# EAGLE design main-single-esp32 (EAGLE 9.6.2)
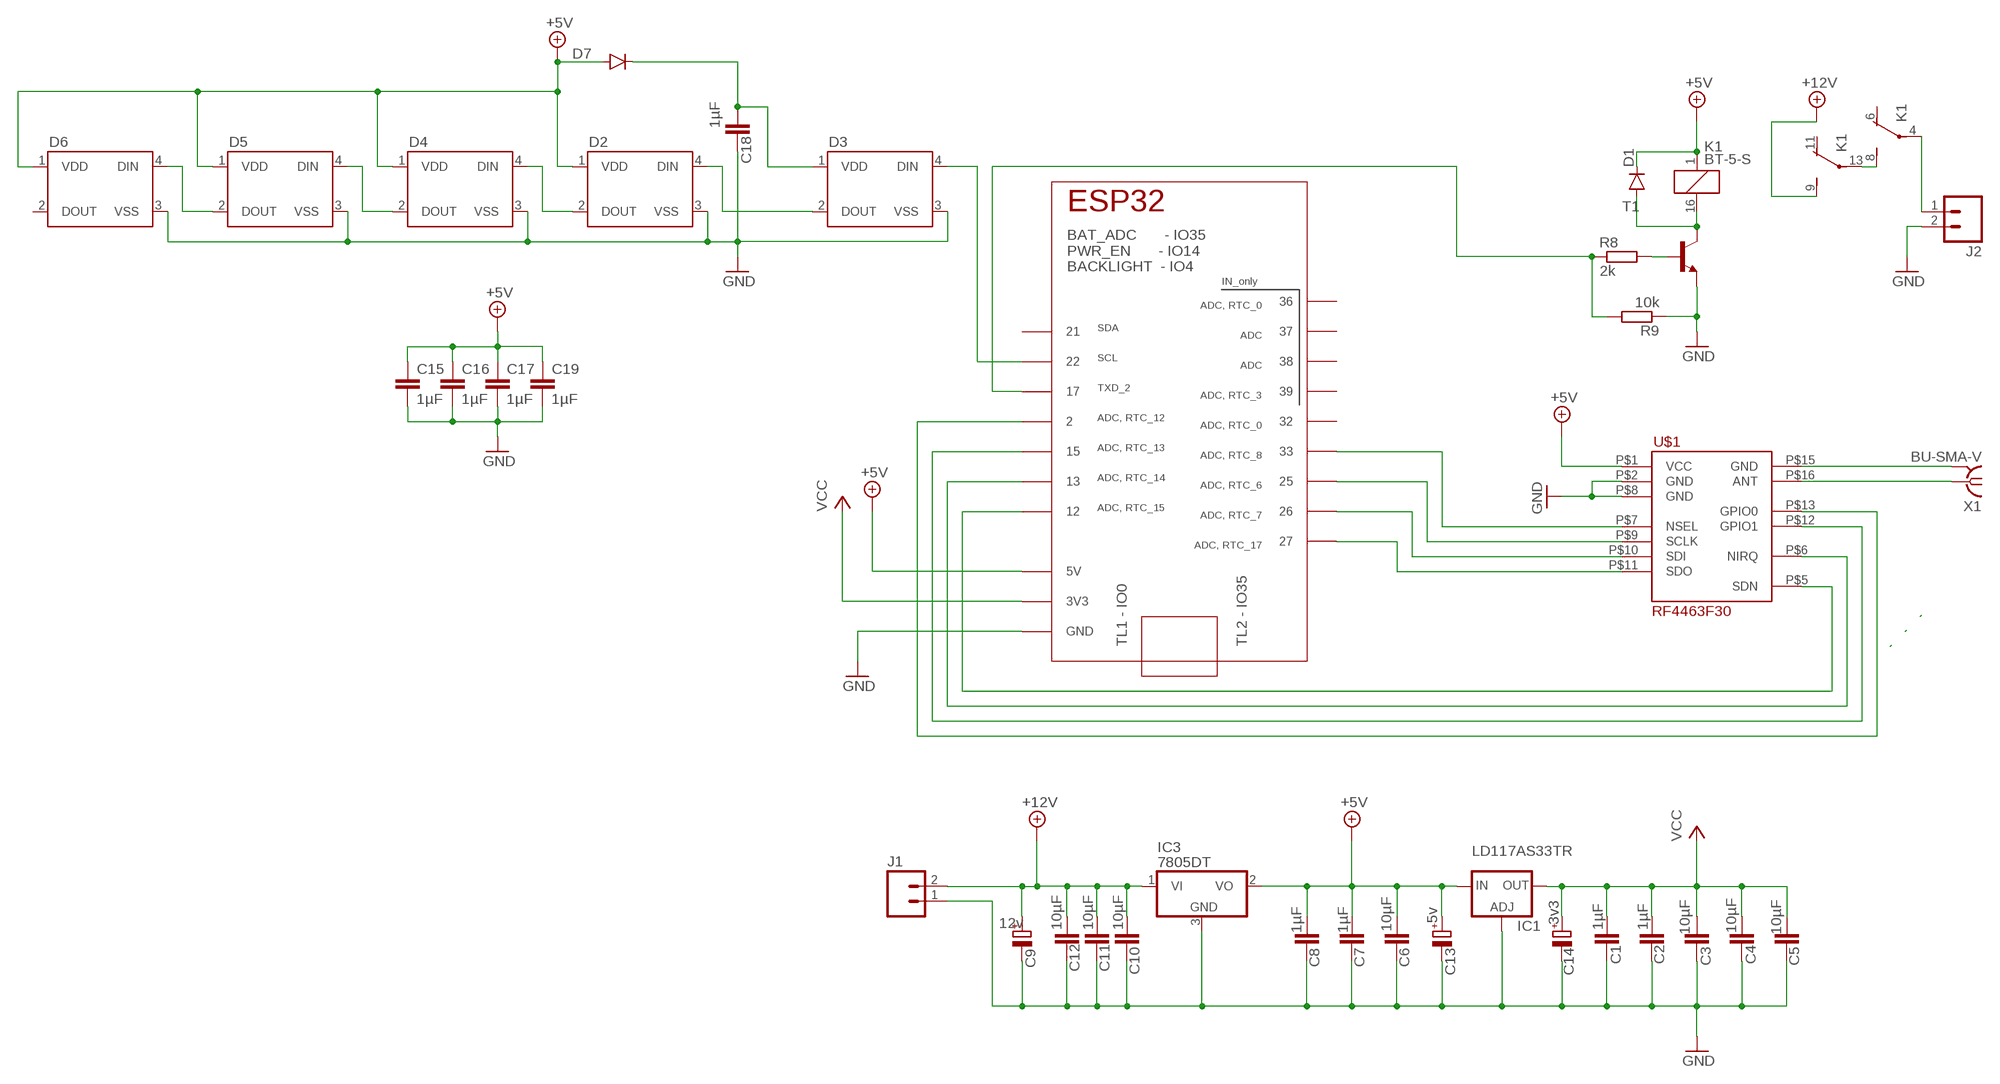
[diagram p0: schematic, sheet 1]

## Parts
C1  1µF  C-EUC1206K  [C1206K]
C2  1µF  C-EUC1206K  [C1206K]
C3  10µF  C-EUC1206K  [C1206K]
C4  10µF  C-EUC1206K  [C1206K]
C5  10µF  C-EUC1206K  [C1206K]
C6  10µF  C-EUC1206K  [C1206K]
C7  1µF  C-EUC1206K  [C1206K]
C8  1µF  C-EUC1206K  [C1206K]
C9  12v  CPOL-EUD/7343-31W  [D/7343-31W]
C10  10µF  C-EUC1206K  [C1206K]
C11  10µF  C-EUC1206K  [C1206K]
C12  10µF  C-EUC1206K  [C1206K]
C13  5v  CPOL-EUD/7343-31W  [D/7343-31W]
C14  3v3  CPOL-EUD/7343-31W  [D/7343-31W]
C15  1µF  C-EUC0805  [C0805]
C16  1µF  C-EUC0805  [C0805]
C17  1µF  C-EUC0805  [C0805]
C18  1µF  C-EUC0805  [C0805]
C19  1µF  C-EUC0805  [C0805]
D1  DIODESMA  [SMA-DIODE]
D2  WS2812B  [WS2812B]
D3  WS2812B  [WS2812B]
D4  WS2812B  [WS2812B]
D5  WS2812B  [WS2812B]
D6  WS2812B  [WS2812B]
D7  DIODESMA  [SMA-DIODE]
IC1  LD117AS33TR  [SOT223]
IC2  TTGO_DISP  [TTGO_DISP_DEFAULT]
IC3  7805DT  [TO252]
J1  M023.5MM-NO_SILK  [SCREWTERMINAL-3.5MM-2-NS]
J2  M023.5MM-NO_SILK  [SCREWTERMINAL-3.5MM-2-NS]
K1  BT-5-S  [BT-XX-S]
R8  2k  R-EU_R1206  [R1206]
R9  10k  R-EU_R1206  [R1206]
T1  MMBT2222ALT1-NPN-SOT23-BEC  [SOT23-BEC]
U$1  RF4463F30  [NICERF_16PIN_SPI_TRANSCEIVER]
X1  BU-SMA-V  [BU-SMA-V]

## Nets
+5V: C6.1 C7.1 C8.1 C13.+ C15.1 C16.1 C17.1 C19.1 D1.C D2.1(VDD) D4.1(VDD) D5.1(VDD) D6.1(VDD) D7.A IC1.3(IN) IC2.5V IC3.2(VO) K1.1 U$1.P$1(VCC)
+12V: C9.+ C10.1 C11.1 C12.1 IC3.1(VI) J1.2 K1.9(-2:S)
GND: C1.2 C2.2 C3.2 C4.2 C5.2 C6.2 C7.2 C8.2 C9.- C10.2 C11.2 C12.2 C13.- C14.- C15.2 C16.2 C17.2 C18.2 C19.2 D2.3(VSS) D3.3(VSS) D4.3(VSS) D5.3(VSS) D6.3(VSS) IC1.1(ADJ) IC2.GND_1(GND) IC2.GND_2(GND) IC2.GND_3(GND) IC2.GND_4(GND) IC2.GND_5(GND) IC3.3(GND) J1.1 J2.2 R9.1 T1.E U$1.P$2(GND) U$1.P$8(GND)
N$4: IC2.27 U$1.P$11(SDO)
N$6: IC2.26 U$1.P$10(SDI)
N$8: IC2.25 U$1.P$9(SCLK)
N$9: U$1.P$16(ANT) X1.1
N$10: U$1.P$15(GND) X1.2 X1.3 X1.4 X1.5
N$13: IC2.33 U$1.P$7(NSEL)
N$14: IC2.12 U$1.P$5(SDN)
N$15: R8.2 T1.B
N$16: D2.4(DIN) D3.2(DOUT)
N$17: D1.A K1.16 T1.C
N$18: IC2.13 U$1.P$6(NIRQ)
N$19: IC2.15 U$1.P$12(GPIO1)
N$20: IC2.2 U$1.P$13(GPIO0)
N$21: IC2.17 R8.1 R9.2
N$22: D2.2(DOUT) D4.4(DIN)
N$23: D4.2(DOUT) D5.4(DIN)
N$24: D5.2(DOUT) D6.4(DIN)
N$25: K1.8(-1:S) K1.13(-2:P)
N$26: J2.1 K1.4(-1:P)
N$27: D3.4(DIN) IC2.22
N$28: C18.1 D3.1(VDD) D7.C
VCC: C1.1 C2.1 C3.1 C4.1 C5.1 C14.+ IC1.4(OUT) IC2.3V3_1(3V3) IC2.3V3_2(3V3)
Unconnected: D6.2(DOUT) IC2.21 IC2.32 IC2.36 IC2.37 IC2.38 IC2.39 K1.6(-1:O) K1.11(-2:O)

## Library data of the parts
C1-C8 C10-C12 C15-C19 = rcl:C-EU: CAPACITOR, European symbol; SPICEPREFIX: C
C9 C13 C14 = rcl:CPOL-EU: POLARIZED CAPACITOR, European symbol; SPICEPREFIX: C
D1 D7 = SparkFun-DiscreteSemi:DIODE: Diode These are standard reverse protection diodes and small signal diodes. SMA package can handle up to about 1A. SOD-323 can handle about 200mA. What the SOD-323 package when ordering, there are some mfgs out there that are 5-pin packages.
D2-D6 = SparkFun-LED:WS2812B: WS2812B - Intelligent control LED integrated light source Technical Specifications: Power Supply Voltage (VDD): 3.5 to 5.3 V Input Voltage (VI): -0.5 to VDD+0.5 V Operating Junction Temperature (Topt): -25°C to +80°C Storage Temperature Range (Tstg): -55°C to +150°C; PROD_ID: DIO-12503
IC1 = v-reg:LD117A?*: Low drop fixed and adjustable positive voltage regulators 1 A Source: http://www.st.com/stonline/products/literature/ds/7194/ld1117axx.pdf
IC2 = TTGO_LCD_DISP:TTGO_DISP; HEIGHT: 11
IC3 = linear:78*: Positive VOLTAGE REGULATOR Source: http://cache.national.com/ds/LM/LM78L05.pdf http://www.fairchildsemi.com/ds/LM/LM7805.pdf
J1 J2 = SparkFun-Connectors:M02: Standard 2-pin 0.1" header. Use with - straight break away headers ( PRT-00116) - right angle break away headers (PRT-00553) - swiss pins (PRT-00743) - machine pins (PRT-00117) - female headers (PRT-00115) Molex polarized connector foot print use with: PRT-08233 with associated crimp pins and housings. 2.54_SCREWTERM for use with PRT-10571. 3.5mm Screw Terminal footprints for PRT-08084 5mm Screw Terminal footprints for use with PRT-08432; PROD_ID: CONN-08399
K1 = relay:BT-*-S: KLEIN RELAIS WASCHDICHT 2 Wechsler Distriibutor: Conrad Electronic, Bestell Nr.: 505226-13 - 24V 505226-13 - 5V 505170-13 - 12V 505170-13 - 48V Bestar Electric Ltd. Source: http://www2.produktinfo.conrad.com/datenblaetter/500000-524999/505226-da-01-en-Kleinrelais_waschdicht_24V.pdf; OC_FARNELL: unknown; OC_NEWARK: unknown
R8 R9 = resistor:R-EU_: RESISTOR, European symbol
T1 = transistor-neu-to92:*-NPN-: NPN Transistror
U$1 = Nomeo-Transceivers:RF4463F30
X1 = con-coax:BU-SMA-V: FEMALE SMA CONNECTOR Radiall distributor RS 112-3794; OC_FARNELL: unknown; OC_NEWARK: unknown

## Net classes
0 default: width 0.61 mm, drill 0.4 mm, clearance 0.254 mm

## Board
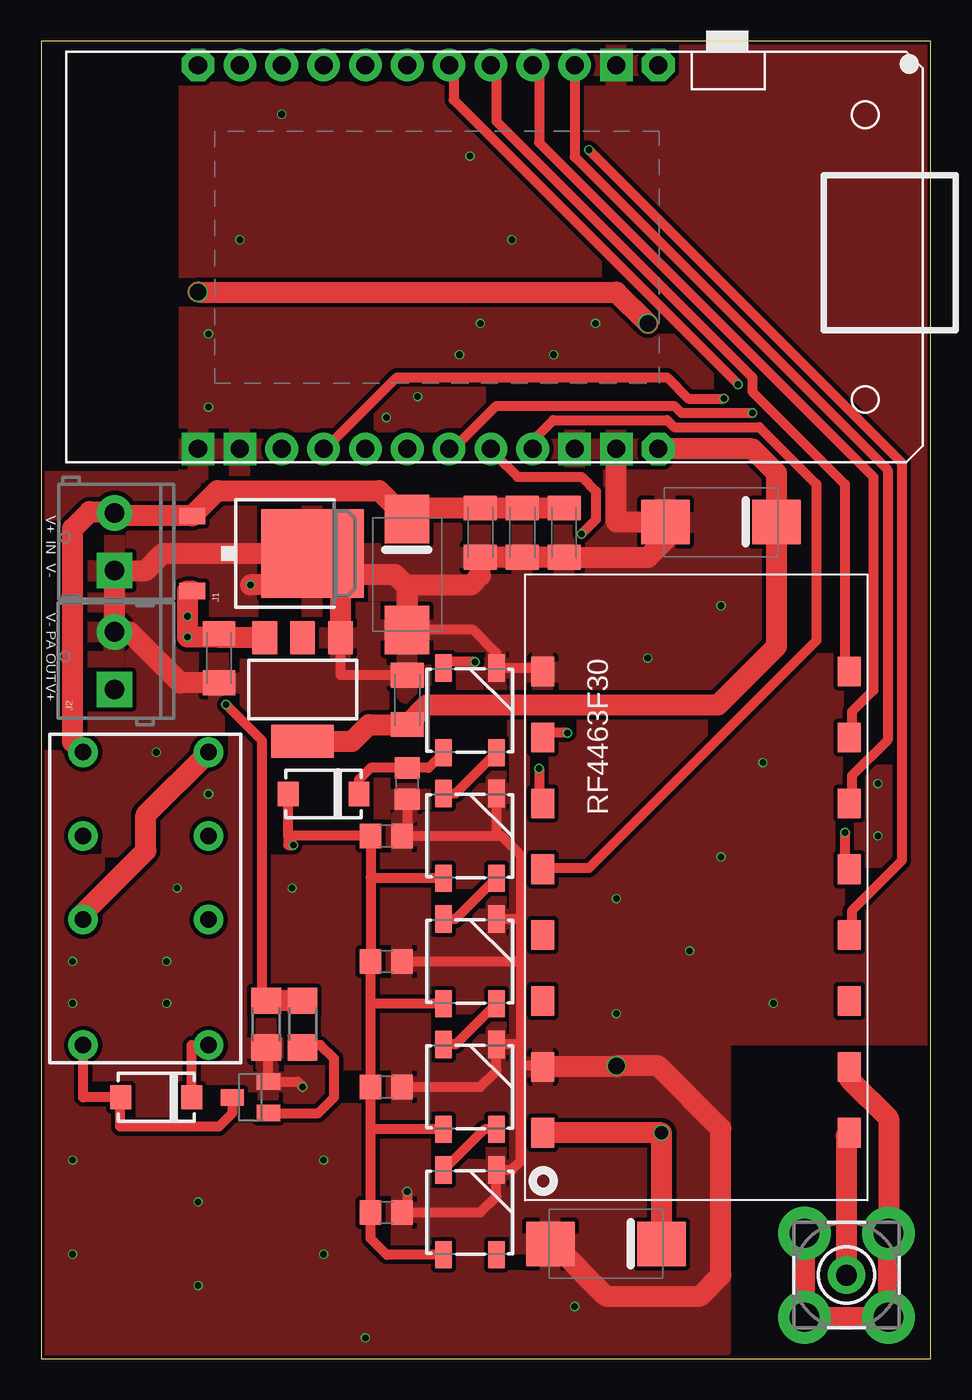
[diagram p1: board, top side]
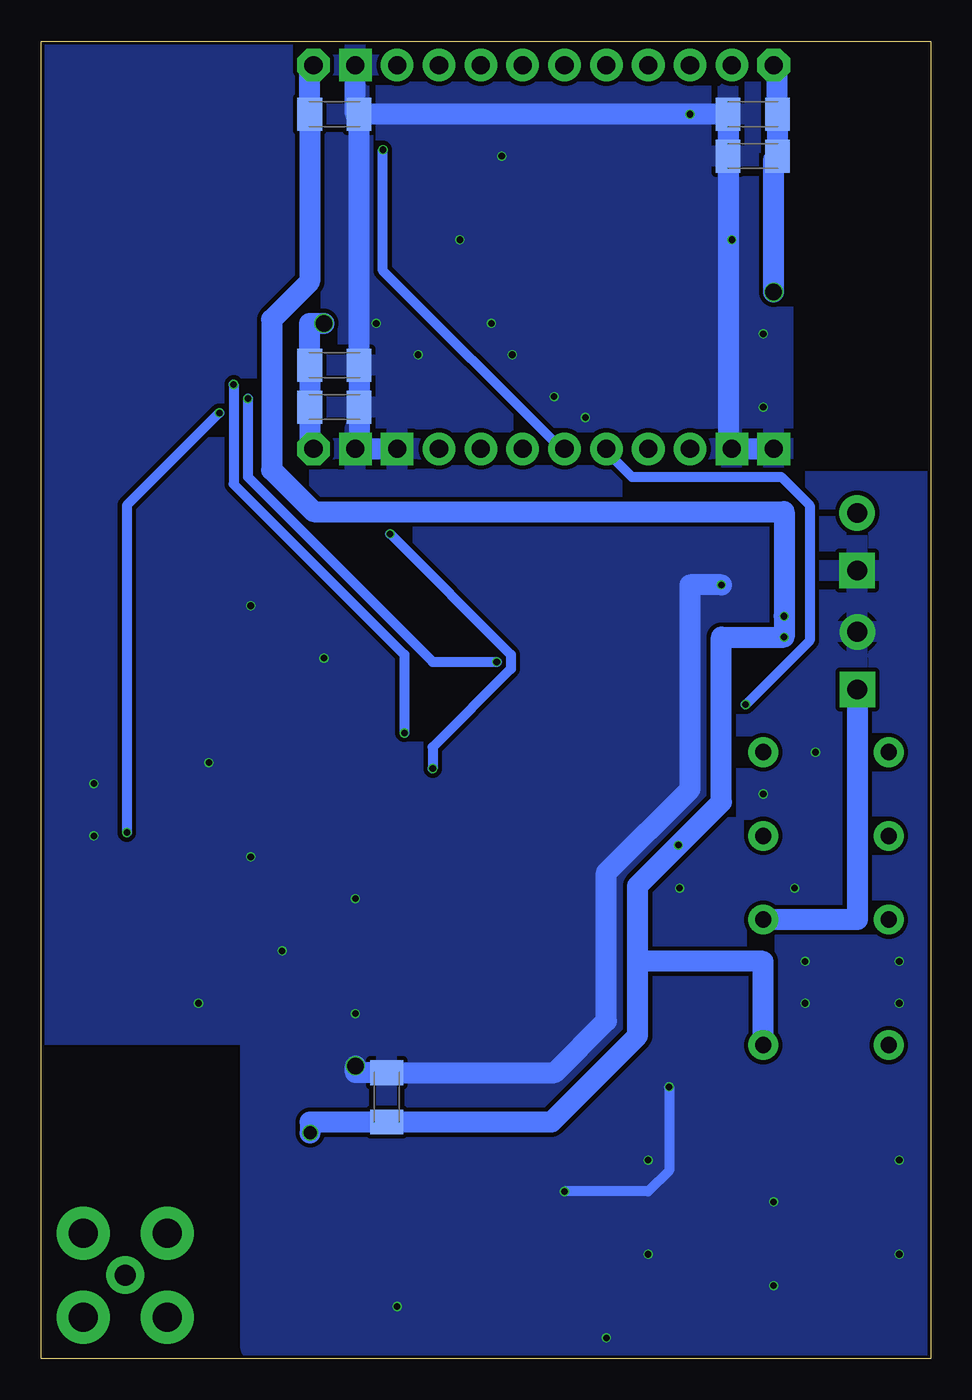
[diagram p2: board, bottom side, seen from below]

Size 54 x 80 mm. Coordinates in mm from the lower left corner, seen from the top.
Outline: 0,0 54,0 54,80 0,80 0,0
Copper layers (1*16): Top 0.035mm / dielectric 1.6mm / Bottom 0.035mm
Design rules "jlcpcb-2layers": minimum track width 5mil, minimum drill 0.3mm, track to track 5mil, track to pad 5mil, pad to pad 5mil, via to via 5mil, smd to smd 5mil, copper to edge 0.2mm, drill to drill 6mil, minimum pad ring 10mil, minimum via ring 3mil, stop-mask expansion 4mil, vias tented up to drill 0mil, thermal gap 10mil
tRestrict: area 0.6,54 to 8.3,79.4
bRestrict: area 0.6,54 to 8.3,79.4

### Footprints (pad centres in the part's own frame; a part is rotated, then mirrored left to right if it is on the bottom)
C1206K = smd 1.5 x 2: 1 -1.5,0; 2 1.5,0
D/7343-31W = smd 2.95 x 2.7: + 3.375,0; - -3.375,0
C0805 = smd 1.3 x 1.5: 1 -0.95,0; 2 0.95,0
SMA-DIODE = smd 1.27 x 1.47: A -2.15,0; C 2.15,0
WS2812B = smd 1.651 x 1: 1 -2.577,1.6; 2 -2.577,-1.6; 3 2.577,-1.6; 4 2.577,1.6
SOT223 = smd 1.5 x 2: 1 -2.3,-3.15; 2 0,-3.15; 3 2.3,-3.15 | smd 3.8 x 2: 4 0,3.15
TTGO_DISP_DEFAULT = drill 1.1: 2 12.7,0; 12 20.32,0; 13 17.78,0; 15 15.24,0; 17 10.16,0; 21 5.08,0; 22 7.62,0; 25 17.78,23.3; 26 20.32,23.3; 27 22.86,23.3; 32 12.7,23.3; 33 15.24,23.3; 36 2.54,23.3; 37 5.08,23.3; 38 7.62,23.3; 39 10.16,23.3 | drill 1.1 octagon: 3V3_1 0,23.3; 3V3_2 27.94,0; 5V 27.94,23.3 | drill 1.1 square: GND_1 0,0; GND_2 2.54,0; GND_3 22.86,0; GND_4 25.4,0; GND_5 25.4,23.3
TO252 = smd 1 x 1.6: 1 -2.28,-4.8; 2 2.28,-4.8 | smd 5.4 x 6.2: 3 0,2.5
SCREWTERMINAL-3.5MM-2-NS = drill 1.2 pad 2.032 square: 1 0,0 | drill 1.2 pad 2.032: 2 3.5,0
BT-XX-S = drill 1 pad 1.7: 1 -8.89,-3.81; 4 -1.27,-3.81; 6 3.81,-3.81; 8 8.89,-3.81; 9 8.89,3.81; 11 3.81,3.81; 13 -1.27,3.81; 16 -8.89,3.81
R1206 = smd 1.6 x 1.803: 1 -1.422,0; 2 1.422,0
SOT23-BEC = smd 1 x 1.4: B -0.95,-1.1; C 0,1.1; E 0.95,-1.1
NICERF_16PIN_SPI_TRANSCEIVER = smd 1.8 x 1.4: P$1 33.9,-19.7; P$2 29.9,-19.7; P$3 25.9,-19.7; P$4 21.9,-19.7; P$5 17.9,-19.7; P$6 13.9,-19.7; P$7 9.9,-19.7; P$8 5.9,-19.7; P$9 5.9,-1.1; P$10 9.9,-1.1; P$11 13.9,-1.1; P$12 17.9,-1.1; P$13 21.9,-1.1; P$14 25.9,-1.1; P$15 29.9,-1.1; P$16 33.9,-1.1
BU-SMA-V = drill 1.27: 1 0,0 | drill 1.778: 2 -2.55,2.55; 3 2.55,2.55; 4 2.55,-2.55; 5 -2.55,-2.55

### Placement (x,y rotation side)
C1  36.2,57.78 0 bottom
C2  10.79,75.56 180 bottom
C3  10.79,73.03 180 bottom
C4  36.2,60.33 0 bottom
C5  22.23,40.01 90 top
C6  10.79,42.55 270 top
C7  33.02,15.88 90 bottom
C8  36.2,75.56 0 bottom
C9  22.23,47.62 90 top
C10  31.75,50.16 270 top
C11  29.21,50.16 270 top
C12  26.67,50.16 270 top
C13  34.29,6.99 0 top
C14  41.27,50.8 0 top
C15  20.95,24.13 0 top
C16  20.95,16.51 0 top
C17  20.95,8.89 0 top
C18  22.23,34.92 270 top
C19  20.95,31.75 0 top
D1  6.99,15.88 0 top
D2  26.04,31.75 90 top
D3  26.04,39.37 90 top
D4  26.04,24.13 90 top
D5  26.04,16.51 90 top
D6  26.04,8.89 90 top
D7  17.14,34.29 0 top
IC1  15.88,40.64 180 top
IC2  9.53,55.24 0 top
IC3  13.97,48.9 270 top
J1  4.46,47.86 90 top
J2  4.45,40.64 90 top
K1  6.35,27.94 90 top
R8  15.88,20.32 270 top
R9  13.67,20.32 90 top
T1  12.7,15.88 90 top
U$1  50.16,47.62 270 top
X1  48.9,5.08 0 top

### Tracks (layer width: path | path; a pad name or v marks a point on that pad's centre or on a via)
+5V  (via drill 0.4, 0.8)
  Top 0.61: D4.1 20,21.55 | 20,21.55 C15.1 20,29.21 | 20,29.21 C19.1 14.99,31.75 | 20,21.55 C16.1 20,13.93 | 20,13.93 C17.1 20,7.3 20.99,6.31 D6.1 | D5.1 20,13.93 | D2.1 20.04,29.17 20,29.21 | D1.C 9.13,19.05 K1.1 | 14.99,31.75 D7.A | 14.99,31.75 14.99,31.19 v15.31,31.19
  Top 1.27: IC3.2 8.89,46.62 v8.89,45.09 v8.89,43.81 10.79,43.81 C6.1 10.79,43.79 IC1.3 | C13.+ v37.66,13.72 U$1.P$1
  Bottom 1.27: 17.78,24.13 17.78,19.62 23.02,14.38 C7.1 37.66,14.38 v37.66,13.72 | 17.78,24.13 17.78,28.72 v15.31,31.19 12.7,33.8 12.7,43.81 v8.89,43.81 v8.89,45.09 8.89,51.44 37.47,51.44 40.01,53.98 40.01,63.09 37.7,65.41 C8.1 37.7,78.55 IC2.5V | K1.1 10.16,24.13 17.78,24.13
+12V
  Top 1.27: C10.1 C11.1 C12.1 22.23,51.66 C9.+ 20.52,52.7 10.7,52.7 IC3.1 4.64,51.17 J1.2 4.46,51.44 2.94,51.44 1.91,50.41 1.91,37.47 K1.9
GND  (via drill 0.4, 1)
  Top 0.61: 29.11,17.78 29.11,12 28.57,11.47 D6.3 27.64,9.86 26.67,8.89 C17.2 22.23,8.89 v22.23,10.16 | 29.11,17.78 29.11,19.09 | 29.11,19.09 D5.3 27.64,17.48 26.67,16.51 C16.2 | D4.3 29.11,26.71 | 29.11,26.71 29.11,24.13 | 29.11,24.13 29.11,19.09 | C15.2 29.11,24.13 | 27.64,31.75 C19.2 22.23,31.75 C18.2 | D2.3 27.64,31.75 | C5.2 18.18,41.51 IC1.1 | U$1.P$2 30.46,17.78 29.11,17.78 | 27.64,31.75 27.94,31.75 29.11,30.58 29.11,26.71 | U$1.P$8 30.46,41.95 D3.3 27.64,42.85 26.23,44.25 C9.- | 13.8,18.9 T1.E 15.56,16.82 v15.88,16.51
  Top 1.27: 18.18,47.62 21.48,47.62 22.23,46.88 C9.- 22.23,46.99 26.1,46.99 26.67,47.56 C12.2 C11.2 C10.2 36.83,48.66 37.9,49.73 C14.- 34.92,50.8 IC2.GND_4 | U$1.P$2 34.92,17.73 v34.92,17.78 37.47,17.78 41.27,13.97 41.27,5.08 40.01,3.81 34.29,3.81 31.11,6.99 C13.- | 18.18,46.99 18.18,47.62 | C6.2 8.46,41.05 5.36,44.14 J2.2 J1.1 6.35,47.86 7.38,48.9 IC3.3 16.47,50.16 18.18,50.16 18.18,47.62 | 13.8,18.9 R9.1 | IC1.1 18.18,46.99 | 18.18,46.99 v12.7,46.99
  Bottom 0.61: v15.88,16.51 15.88,11.43 17.14,10.16 v22.23,10.16
  Bottom 1.27: IC2.GND_5 34.92,75.56 C8.2 | v34.92,17.78 34.92,17.38 C7.2 22.82,17.38 19.68,20.52 19.68,29.52 14.61,34.59 14.61,46.99 v12.7,46.99 | C8.2 v14.61,75.56 C2.2 C3.2 12.29,55.24 IC2.GND_2 IC2.GND_1 | C8.2 C4.2 C1.2 34.7,55.24 IC2.GND_4 IC2.GND_3
  other vias: 26.04,73.03 28.57,67.94 12.06,67.94 10.16,62.23 10.16,57.78 25.4,60.96 26.67,62.87 31.11,60.96 33.66,62.87 20.95,57.15 22.86,58.42 10.16,34.29 8.26,28.57 15.24,28.57 1.91,12.06 1.91,6.35 17.14,6.35 9.53,4.45 9.53,9.53 17.14,12.06 19.68,1.27 32.38,3.17 34.92,20.95 44.45,21.59 34.92,27.94 41.27,30.48 39.37,24.77 43.81,36.2 36.83,42.55 41.27,45.72 50.8,31.75 50.8,34.92 6.99,36.83 1.91,24.13 1.91,21.59 7.62,24.13 7.62,21.59
  pour Top: 8.26,79.38 8.26,53.98 0.64,53.98 0.64,0.64 41.27,0.64 41.27,19.68 53.98,19.68 53.98,79.38
  pour Bottom: 8.26,79.38 8.26,53.98 0.64,53.98 0.64,0.64 41.27,0.64 41.27,19.68 53.98,19.68 53.98,79.38
N$4
  Top 0.61: IC2.27 32.38,72.97 51.38,53.98 51.38,37.57 49.23,35.41 49.23,34.11 U$1.P$11
N$6
  Top 0.61: U$1.P$10 49.23,38 49.23,39.29 50.52,40.59 50.52,53.54 30.23,73.84 30.23,78.16 IC2.26
N$8
  Top 0.61: U$1.P$9 48.79,41.88 48.79,53.11 43.18,58.73 43.18,59.59 27.64,75.13 27.64,78.16 IC2.25
N$9
  Top 1.27: U$1.P$16 48.87,13.53 48.87,5.11 X1.1
N$10
  Top 1.27: U$1.P$15 49.06,16.98 51.45,14.6 X1.3 X1.4 X1.5 X1.2
N$13  (via drill 0.4)
  Top 0.61: v31.95,38 30.66,38 U$1.P$7 | v42.32,59.16 25.04,76.43 25.04,78.16 IC2.33
  Bottom 0.61: v31.95,38 31.95,42.75 42.32,53.11 v42.32,59.16
N$14
  Top 0.61: U$1.P$5 30.66,29.79 33.25,29.79 47.07,43.61 47.07,53.11 43.61,56.57 38.43,56.57 38,57 31.09,57 30.23,56.13 30.23,55.27 IC2.12
N$15
  Top 0.61: T1.B 16.82,14.93 17.78,15.88 17.78,18.22 16.95,19.05 16.03,19.05 R8.2
N$16
  Top 0.61: D2.4 25.17,34.33 D3.2
N$17
  Top 0.61: T1.C 11.6,14.9 10.79,14.1 4.8,14.1 4.8,15.88 D1.A 2.54,15.88 K1.16
N$18  (via drill 0.4)
  Top 0.61: v30.23,35.84 30.23,34.11 U$1.P$6 | v32.82,50.09 33.68,50.95 33.68,52.68 32.82,53.54 28.93,53.54 27.64,54.84 IC2.13
  Bottom 0.61: v30.23,35.84 30.23,37.13 25.48,41.88 25.48,42.75 v32.82,50.09
N$19  (via drill 0.4)
  Top 0.61: v48.79,31.95 48.79,29.79 U$1.P$12 | v43.18,57.43 38.86,57.43 38.43,57.86 27.64,57.86 25.04,55.27 IC2.15
  Bottom 0.61: v48.79,31.95 48.79,51.82 v43.18,57.43
N$20  (via drill 0.4)
  Top 0.61: v33.25,73.41 52.25,54.41 52.25,30.23 49.23,27.2 49.23,25.91 U$1.P$13
  Bottom 0.61: v33.25,73.41 33.25,66.06 22.45,55.27 IC2.2
N$21  (via drill 0.4)
  Top 0.61: v11.23,39.73 13.39,37.57 13.39,22.02 R9.2
  Top 1.27: R8.1 R9.2
  Bottom 0.61: v11.23,39.73 7.34,43.61 7.34,51.82 9.07,53.54 18.14,53.54 19.43,54.84 IC2.17
N$22
  Top 0.61: D4.4 25.17,26.71 D2.2
N$23
  Top 0.61: D4.2 25.17,19.09 D5.4
N$24
  Top 0.61: D5.2 26.9,13.93 D6.4
N$25
  Top 1.27: K1.13 2.54,27.05 6.35,30.86 6.35,33.02 K1.8
N$26
  Bottom 1.27: J2.1 4.45,26.67 K1.4
N$27  (via drill 0.4)
  Top 0.61: v26.34,42.32 24.61,42.32 D3.4 | v41.45,58.29 39.29,58.29 38,59.59 21.59,59.59 17.27,55.27 IC2.22
  Bottom 0.61: v26.34,42.32 30.23,42.32 41.45,53.54 v41.45,58.29
N$28
  Top 0.61: D3.1 23.52,35.88 C18.1 20,35.88 19.3,35.17 D7.C
VCC  (via drill 1)
  Top 1.27: IC1.4 18.89,37.49 19.9,38.51 C5.1 23.42,39.7 41.1,39.7 44.65,43.25 C14.+ 44.65,53.77 43.18,55.24 IC2.3V3_2 | v36.83,62.87 34.93,64.77 v9.53,64.77
  Bottom 1.27: IC2.3V3_1 9.29,78.55 C2.1 C3.1 9.53,72.8 v9.53,64.77 | IC2.3V3_2 37.7,55.24 C1.1 C4.1 37.7,62.87 v36.83,62.87

### Text on the board
tNames: V+ | IN | V- | V- | PA OUT | V+
tStop: Jelmer's POCSAG Modem
bStop: Jelmer's POCSAG Modem